# Altium schematic sheet ethernet.SchDoc
size A
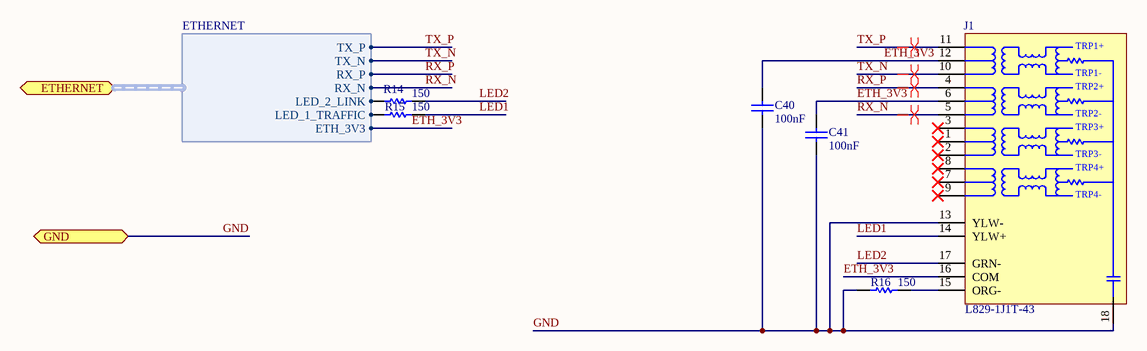
[diagram p0: ethernet.SchDoc]

## Parts
C40  value 100nF  [0805]  (hidden comment: CAP)
C41  value 100nF  [0805]  (hidden comment: CAP)
J1  L829-1J1T-43  [L829-1J1T-43]
R14  value 150  [0805]  (hidden comment: RES)
R15  value 150  [0805]  (hidden comment: RES)
R16  value 150  [0805]  (hidden comment: RES)

## Ports
ETHERNET (harness ETHERNET), GND

## Harnesses
ETHERNET: ETH_3V3, LED_1_TRAFFIC, LED_2_LINK, RX_N, RX_P, TX_N, TX_P

## Nets
ETH_3V3: C40.2 C41.2 J1.6(TRCT2) J1.12(TRCT1) J1.16(COM) ; port ETHERNET.ETH_3V3
GND: C40.1 C41.1 J1.13(YLW-) J1.18(SHEILD) R16.1 ; port GND
LED1: J1.14(YLW+) R15.2
LED2: J1.17(GRN-) R14.2
RX_N: J1.5(TRD2-) ; port ETHERNET.RX_N
RX_P: J1.4(TRD2+) ; port ETHERNET.RX_P
TX_N: J1.10(TRD1-) ; port ETHERNET.TX_N
TX_P: J1.11(TRD1+) ; port ETHERNET.TX_P
NetJ1_15: J1.15(ORG-) R16.2
NetR14_1: R14.1 ; port ETHERNET.LED_2_LINK
NetR15_1: R15.1 ; port ETHERNET.LED_1_TRAFFIC

Not connected (* = marked no-connect by the designer): J1 1(TRCT3)* 2(TRD3-)* 3(TRD3+)* 7(TRCT4)* 8(TRD4+)* 9(TRD4-)*

## Layout directives
differential pair: RX_N, RX_P, TX_N, TX_P

## Notes on the sheet
- (in symbol L829-1J1T-43) TRP1+; TRP1-; TRP2+; TRP2-; TRP3+; TRP3-; TRP4+; TRP4-

## Library data of the parts
C40 C41 = CAP: Tolerance: 5%; Voltage: 10V; Manufacturer: *; Manufacturer P/N: *; Tr: *; Distributor: Digi-Key; Distributor P/N: *
J1 = L829-1J1T-43: MagJack 12-core 10/100/1000 Base-T Ethernet Connector; Manufacturer: Bell Fuse Inc.; Manufacturer P/N: L829-1J1T-43; Distributor: DigiKey; Distributor P/N: 380-1110-ND
R14-R16 = RES: Tolerance: 5%; Tcr: *; Manufacturer: *; Manufacturer P/N: *; Tr: *; Alternatives: *; Voltage: *; Power: *; Distributor: Digi-Key; Distributor P/N: *